# Altium schematic sheet MainBorad.SchDoc
size A3
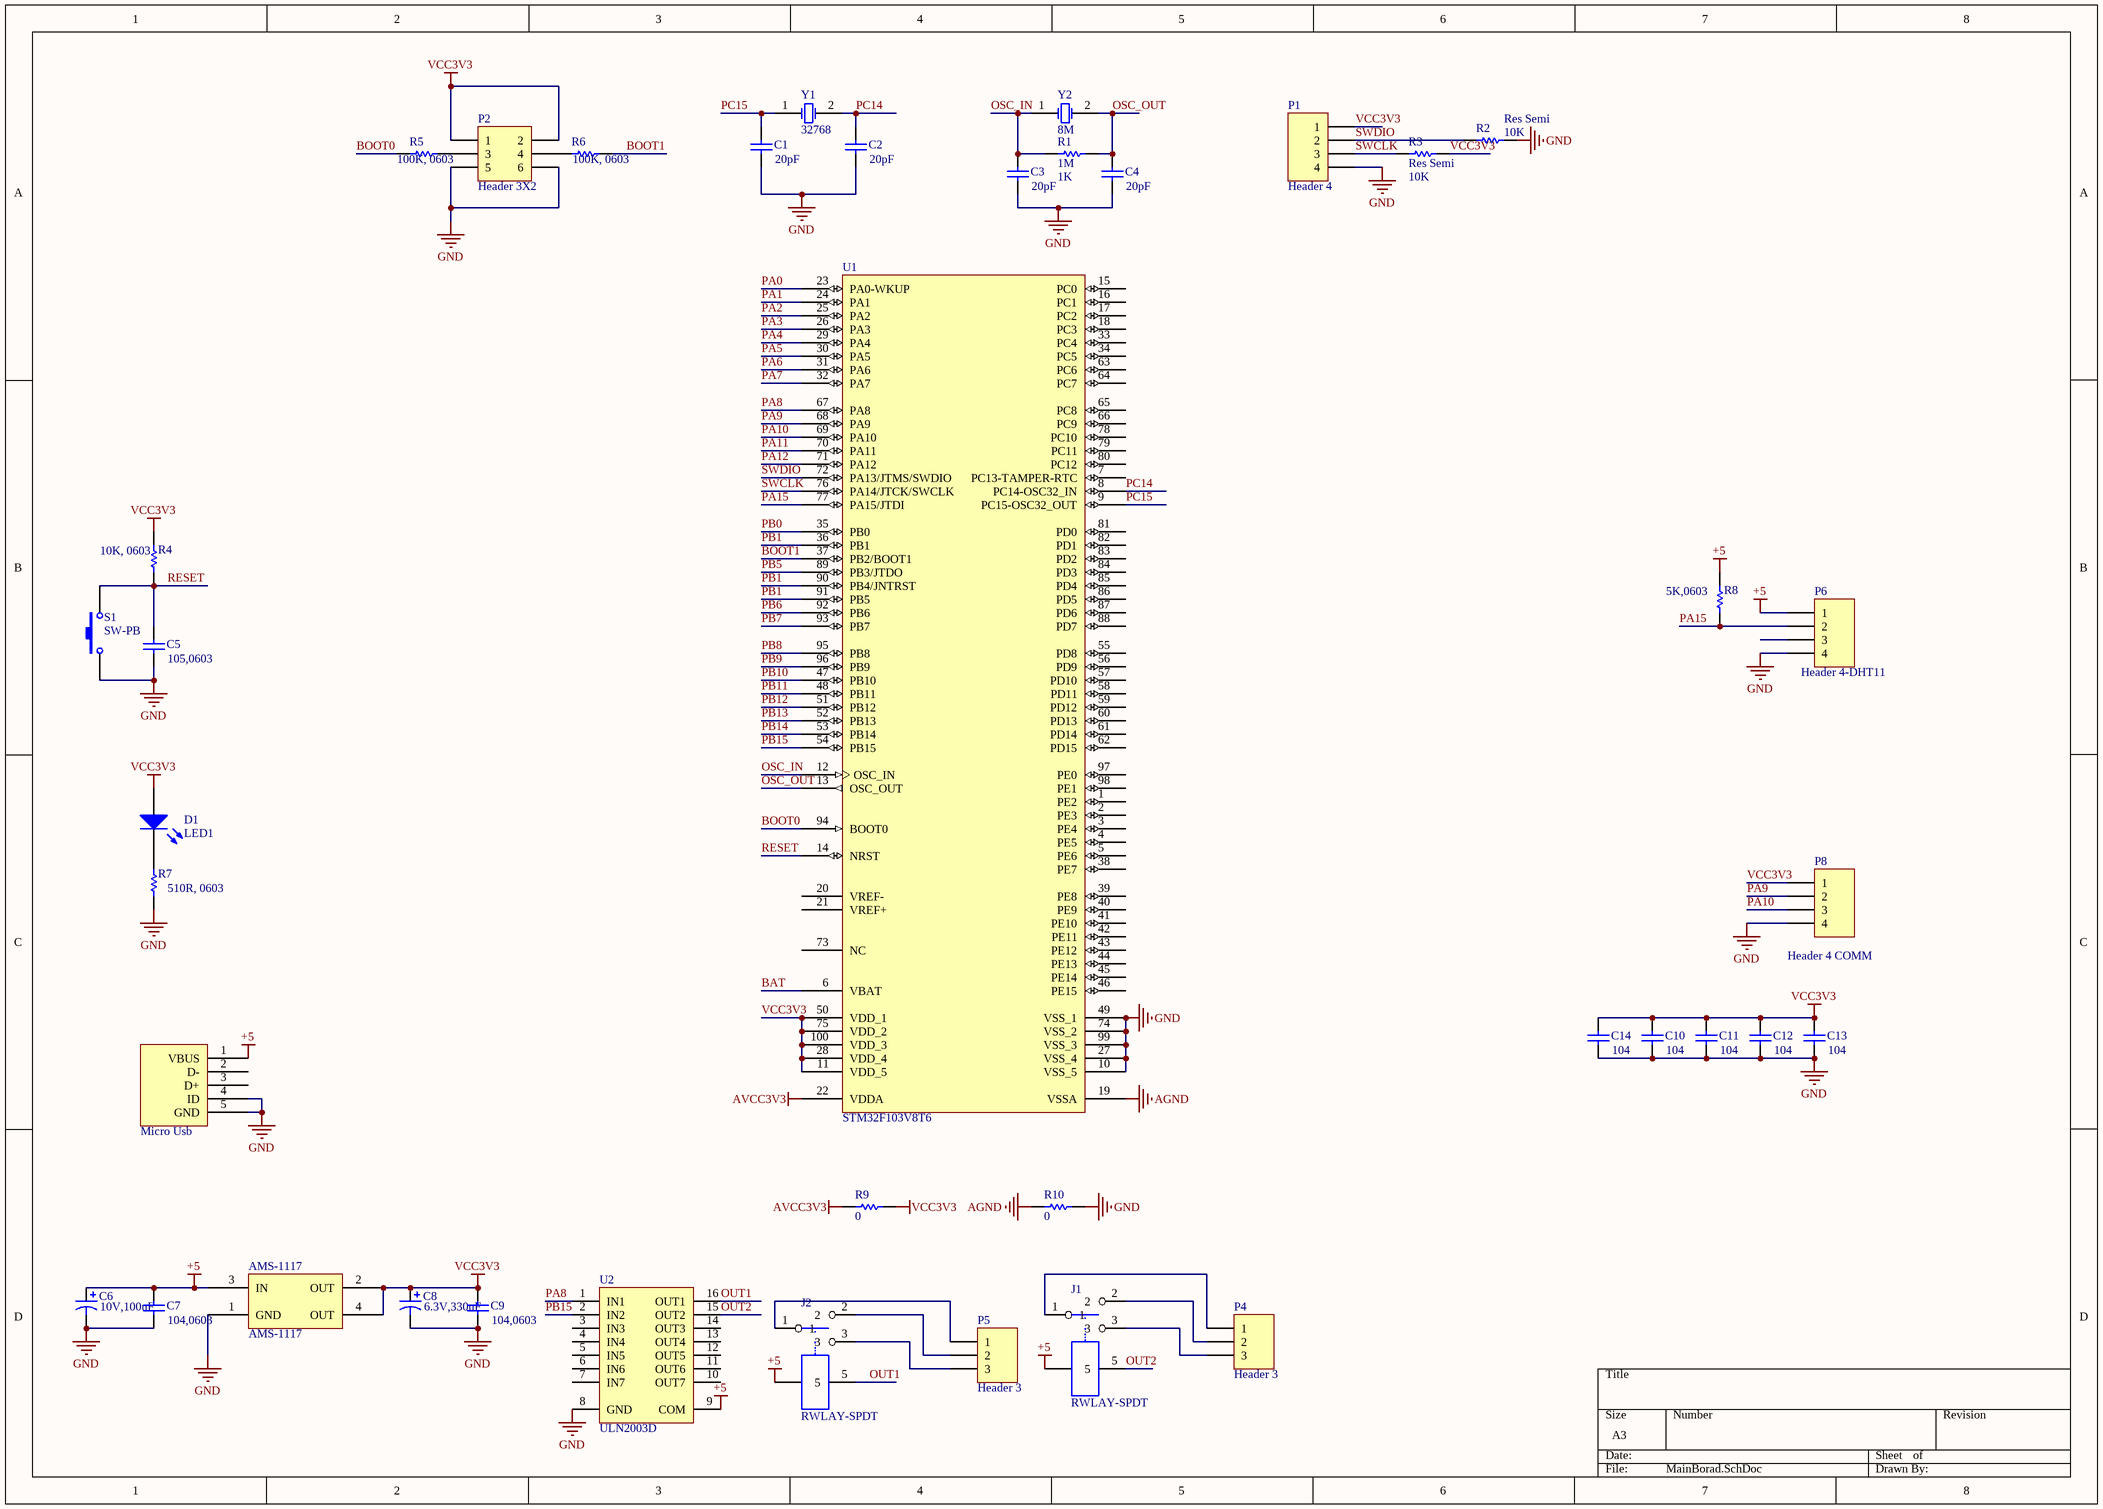
[diagram p0: MainBorad.SchDoc]

## Parts
AMS-1117  AMS-1117  [SOT223]
C1  value 20pF  [0805C]  (hidden comment: Cap Semi)
C2  value 20pF  [0805C]  (hidden comment: Cap Semi)
C3  value 20pF  [0805C]  (hidden comment: Cap Semi)
C4  value 20pF  [0805C]  (hidden comment: Cap Semi)
C5  value 105,0603  [0805C]  (hidden comment: Cap Semi)
C6  value 10V,100uF  [7343C]  (hidden comment: Cap Pol3)
C7  value 104,0603  [0805C]  (hidden comment: Cap Semi)
C8  6.3V,330uF  [7343C]
C9  value 104,0603  [0805C]  (hidden comment: Cap Semi)
C10  value 104  [0805C]  (hidden comment: Cap Semi)
C11  value 104  [0805C]  (hidden comment: Cap Semi)
C12  value 104  [0805C]  (hidden comment: Cap Semi)
C13  value 104  [0805C]  (hidden comment: Cap Semi)
C14  value 104  [0805C]  (hidden comment: Cap Semi)
D1  LED1  [0805]
J1  RWLAY-SPDT  [relay]
J2  RWLAY-SPDT  [relay]
Micro_Usb  Micro Usb  [Micro_USB]  (value not drawn)
P1  Header 4  [HDR1X4]
P2  Header 3X2  [HDR2X3]
P4  Header 3  [HDR1X3]
P5  Header 3  [HDR1X3]
P6  Header 4-DHT11  [HDR1X4]
P8  Header 4 COMM  [HDR1X4]
R1  1M  value 1K  [0805R]
R2  Res Semi  value 10K  [0805R]
R3  Res Semi  value 10K  [0805R]
R4  value 10K, 0603  [0805R]  (hidden comment: Res Semi)
R5  value 100K, 0603  [0805R]  (hidden comment: Res Semi)
R6  value 100K, 0603  [0805R]  (hidden comment: Res Semi)
R7  value 510R, 0603  [0805R]  (hidden comment: Res Semi)
R8  value 5K,0603  [0805R]  (hidden comment: Res Semi)
R9  value 0  [0805R]  (hidden comment: Res Semi)
R10  value 0  [0805R]  (hidden comment: Res Semi)
S1  SW-PB  [SPST-2]
U1  STM32F103V8T6  [LQFP100_N]
U2  ULN2003D  [SO16_N]
Y1  32768  [R38]
Y2  8M  [XTAL1]

## Nets
+5: AMS-1117.3(IN) C6.1 C7.2 J1.4 J2.4 Micro_Usb.1(VBUS) P6.1 R8.2 U2.9(COM)
AGND: R10.2 U1.19(VSSA)
AVCC3V3: R9.2 U1.22(VDDA)
GND: AMS-1117.1(GND) C1.1 C2.1 C3.1 C4.1 C5.1 C6.2 C7.1 C8.2 C9.1 C10.1 C11.1 C12.1 C13.1 C14.1 Micro_Usb.4(ID) Micro_Usb.5(GND) P1.4 P2.5 P2.6 P6.4 P8.4 R2.1 R7.1 R10.1 S1.1 U1.10(VSS_5) U1.27(VSS_4) U1.49(VSS_1) U1.74(VSS_2) U1.99(VSS_3) U2.8(GND)
VCC3V3: AMS-1117.2(OUT) AMS-1117.4(OUT) C8.1 C9.2 C10.2 C11.2 C12.2 C13.2 C14.2 D1.1(A) P1.1 P2.1 P2.2 P8.1 R3.1 R4.2 R9.1 U1.11(VDD_5) U1.28(VDD_4) U1.50(VDD_1) U1.75(VDD_2) U1.100(VDD_3)
BAT: U1.6(VBAT)
BOOT0: R5.2 U1.94(BOOT0)
BOOT1: R6.1 U1.37(PB2/BOOT1)
OSC_IN: C3.2 R1.1 U1.12(OSC_IN) Y2.1(OSC1)
OSC_OUT: C4.2 R1.2 U1.13(OSC_OUT) Y2.2(OSC2)
OUT1: J2.5 U2.16(OUT1)
OUT2: J1.5 U2.15(OUT2)
PA0: U1.23(PA0-WKUP)
PA1: U1.24(PA1)
PA2: U1.25(PA2)
PA3: U1.26(PA3)
PA4: U1.29(PA4)
PA5: U1.30(PA5)
PA6: U1.31(PA6)
PA7: U1.32(PA7)
PA8: U1.67(PA8) U2.1(IN1)
PA9: P8.2 U1.68(PA9)
PA10: P8.3 U1.69(PA10)
PA11: U1.70(PA11)
PA12: U1.71(PA12)
PA15: P6.2 R8.1 U1.77(PA15/JTDI)
PB0: U1.35(PB0)
PB1: U1.36(PB1) U1.90(PB4/JNTRST) U1.91(PB5)
PB5: U1.89(PB3/JTDO)
PB6: U1.92(PB6)
PB7: U1.93(PB7)
PB8: U1.95(PB8)
PB9: U1.96(PB9)
PB10: U1.47(PB10)
PB11: U1.48(PB11)
PB12: U1.51(PB12)
PB13: U1.52(PB13)
PB14: U1.53(PB14)
PB15: U1.54(PB15) U2.2(IN2)
PC14: C2.2 U1.8(PC14-OSC32_IN) Y1.2(OSC2)
PC15: C1.2 U1.9(PC15-OSC32_OUT) Y1.1(OSC1)
RESET: C5.2 R4.1 S1.2 U1.14(NRST)
SWCLK: P1.3 R3.2 U1.76(PA14/JTCK/SWCLK)
SWDIO: P1.2 R2.2 U1.72(PA13/JTMS/SWDIO)
NetD1_2: D1.2(K) R7.2
NetJ1_1: J1.1 P4.1
NetJ1_2: J1.2 P4.2
NetJ1_3: J1.3 P4.3
NetJ2_1: J2.1 P5.1
NetJ2_2: J2.2 P5.2
NetJ2_3: J2.3 P5.3
NetP2_3: P2.3 R5.1
NetP2_4: P2.4 R6.2

Not connected (* = marked no-connect by the designer): Micro_Usb 2(D-) 3(D+); P6 3; U1 1(PE2) 2(PE3) 3(PE4) 4(PE5) 5(PE6) 7(PC13-TAMPER-RTC) 15(PC0) 16(PC1) 17(PC2) 18(PC3) 20(VREF-) 21(VREF+) 33(PC4) 34(PC5) 38(PE7) 39(PE8) 40(PE9) 41(PE10) 42(PE11) 43(PE12) 44(PE13) 45(PE14) 46(PE15) 55(PD8) 56(PD9) 57(PD10) 58(PD11) 59(PD12) 60(PD13) 61(PD14) 62(PD15) 63(PC6) 64(PC7) 65(PC8) 66(PC9) 73(NC) 78(PC10) 79(PC11) 80(PC12) 81(PD0) 82(PD1) 83(PD2) 84(PD3) 85(PD4) 86(PD5) 87(PD6) 88(PD7) 97(PE0) 98(PE1); U2 3(IN3) 4(IN4) 5(IN5) 6(IN6) 7(IN7) 10(OUT7) 11(OUT6) 12(OUT5) 13(OUT4) 14(OUT3)

## Library data of the parts
C1-C5 C7 C9-C14 = Cap Semi: Capacitor (Semiconductor SIM Model); Published: 8-Jun-2000; LatestRevisionDate: 29-May-2009; LatestRevisionNote: IPC-7351 Footprint Added.; PackageReference: C1206; Publisher: Altium Limited; PackageDescription: Chip Capacitor
C6 C8 = Cap Pol3: Polarized Capacitor (Surface Mount); Published: 8-Jun-2000; LatestRevisionDate: 29-May-2009; LatestRevisionNote: IPC-7351 Footprint Added.; PackageReference: C0805; Publisher: Altium Limited; PackageDescription: Chip Capacitor
  C8: Value: 6.3V,330uF
D1 = LED1: Typical RED GaAs LED; Published: 8-Jun-2000; LatestRevisionDate: 08-Jul-2005; LatestRevisionNote: Mech Layer 1 removed.; PackageReference: LED-1; Publisher: Altium Limited; PackageDescription: LED; 2 Leads
P1 P6 P8 = Header 4: Header, 4-Pin; LatestRevisionDate: 17-Jul-2002; LatestRevisionNote: Re-released for DXP Platform.; Publisher: Altium Limited
P2 = Header 3X2: Header, 3-Pin, Dual row; LatestRevisionDate: 17-Jul-2002; LatestRevisionNote: Re-released for DXP Platform.; Publisher: Altium Limited
P4 P5 = Header 3: Header, 3-Pin; LatestRevisionDate: 17-Jul-2002; LatestRevisionNote: Re-released for DXP Platform.; Publisher: Altium Limited
R1-R10 = Res Semi: Semiconductor Resistor; Published: 8-Jun-2000; LatestRevisionDate: 17-Jul-2002; LatestRevisionNote: Re-released for DXP Platform.; PackageReference: AXIAL-0.5; Publisher: Altium Limited; PackageDescription: Axial Device, Thru-Hole; 2 Leads; 0.5 in Pin Spacing
S1 = SW-PB: Switch; Published: 24-Mar-1999; LatestRevisionDate: 17-Jul-2002; LatestRevisionNote: Re-released for DXP Platform.; PackageReference: SPST-2; Publisher: Altium Limited; PackageDescription: Switch; 2 Leads
U1 = STM32F103V8T6: STM32 ARM-based 32-bit MCU with 64 Kbytes Flash, 100-pin LQFP, Industrial Temperature; Published: *; DatasheetVersion: *; PackageVersion: *; PackageReference: *; Publisher: *; PackageDescription: *; ComponentLink1Description: *; ComponentLink1URL: *; ComponentLink2Description: *; ComponentLink2URL: *
U2 = ULN2003D: Seven Darlington Array; Published: 8-Jun-2000; LatestRevisionDate: 13-Apr-2006; LatestRevisionNote: IPC-7351 Footprint Added.; DatasheetVersion: Sep-1998; PackageVersion: May-1998; PackageReference: SO16; Publisher: Altium Limited; PackageDescription: 16-Pin Small Outline Integrated Circuit 1.27 mm Pitch; Code_IPC: SOIC127P600-16; ComponentLink1Description: Manufacturer Link; ComponentLink1URL: http://www.st.com/; ComponentLink2Description: Datasheet; ComponentLink2URL: http://www.st.com/stonline/products/literature/ds/5279/uln2001.pdf
Y1 Y2 = XTAL: Crystal Oscillator; Published: 8-Jun-2000; LatestRevisionDate: 17-Jul-2002; LatestRevisionNote: Re-released for DXP Platform.; PackageReference: R38; Publisher: Altium Limited; PackageDescription: Crystal, Thru-Hole; 2 Leads; Body 3.1 x 8.2 mm (Dia.xH)